# Altium schematic sheet 05- MCU POWER.SchDoc: MCU1
size 420 x 297 mm; Revision: 1.0; SheetNumber: 5; SheetTotal: 13; Project: LOW LEVEL ECU
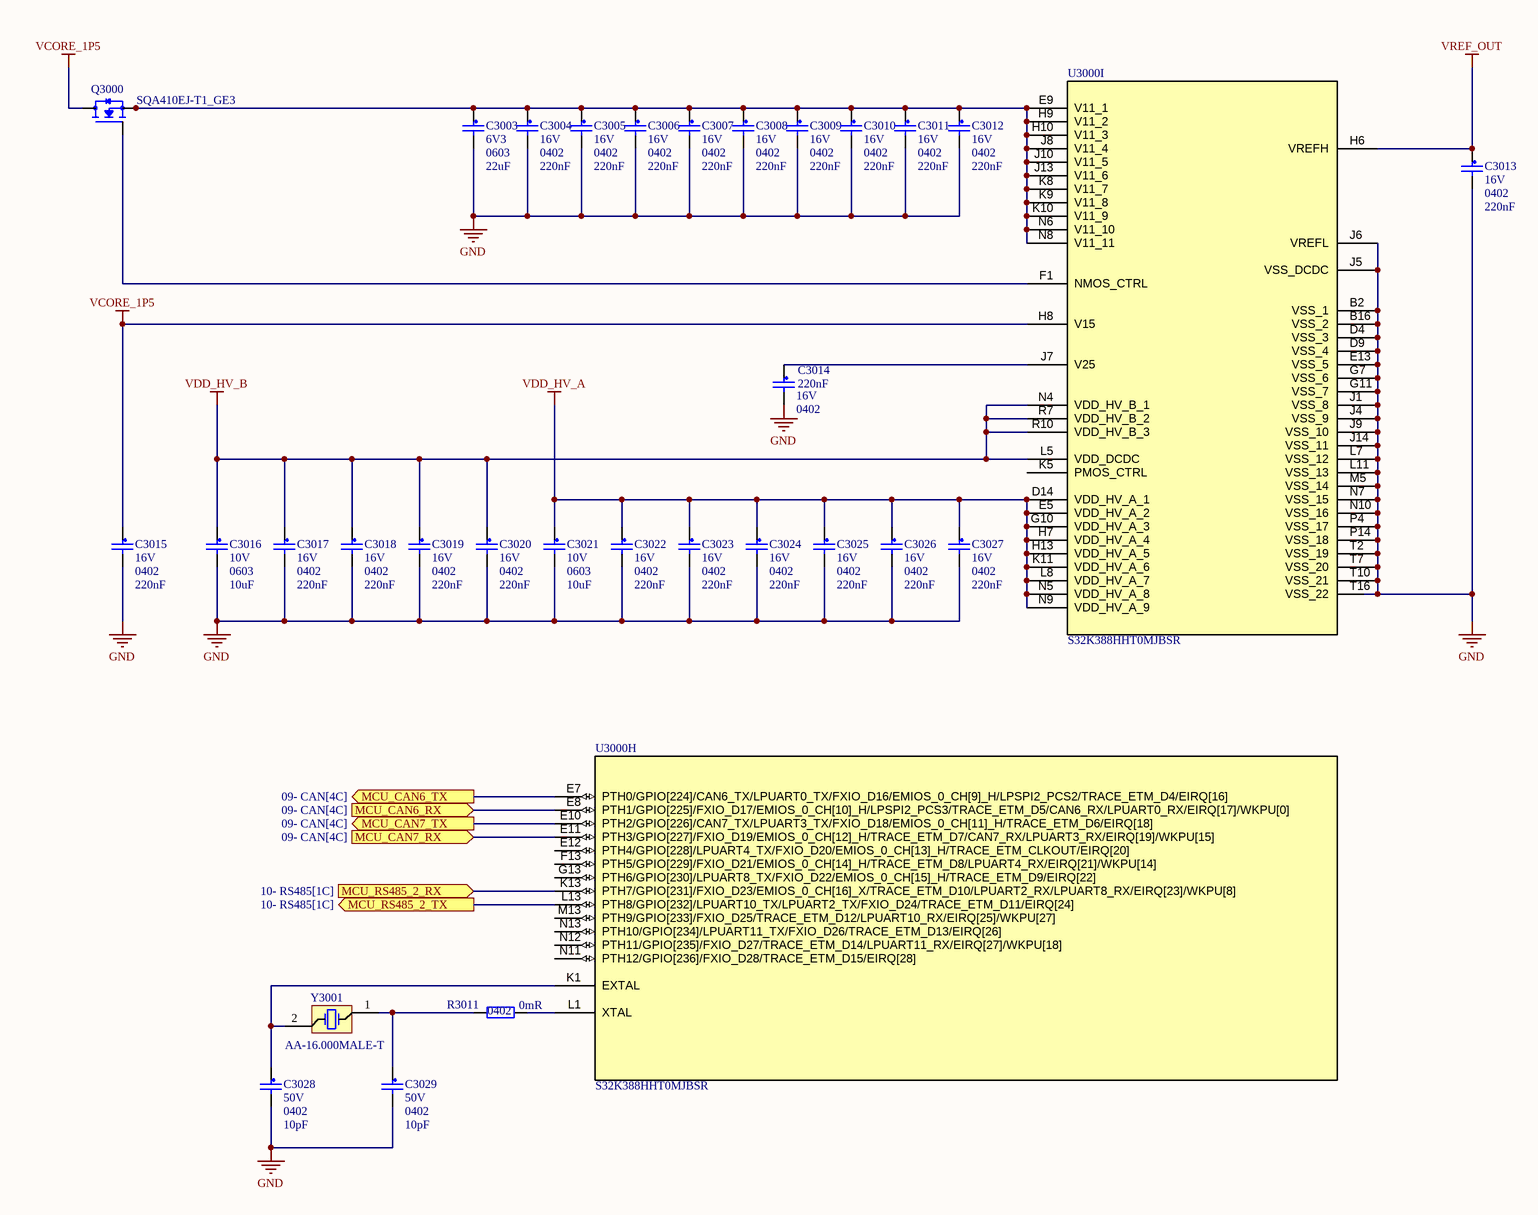
[diagram p0: 05- MCU POWER.SchDoc]

## Parts
C3003  Voltage Rating: 6V3  Case/Package: 0603  Capacitance: 22uF  [CAP0603]  (hidden comment: GRT188C80J226ME13D)
C3004  Voltage Rating: 16V  Case/Package: 0402  Capacitance: 220nF  [CAP0402]  (hidden comment: GCM155R71C224KE02D)
C3005  Voltage Rating: 16V  Case/Package: 0402  Capacitance: 220nF  [CAP0402]  (hidden comment: GCM155R71C224KE02D)
C3006  Voltage Rating: 16V  Case/Package: 0402  Capacitance: 220nF  [CAP0402]  (hidden comment: GCM155R71C224KE02D)
C3007  Voltage Rating: 16V  Case/Package: 0402  Capacitance: 220nF  [CAP0402]  (hidden comment: GCM155R71C224KE02D)
C3008  Voltage Rating: 16V  Case/Package: 0402  Capacitance: 220nF  [CAP0402]  (hidden comment: GCM155R71C224KE02D)
C3009  Voltage Rating: 16V  Case/Package: 0402  Capacitance: 220nF  [CAP0402]  (hidden comment: GCM155R71C224KE02D)
C3010  Voltage Rating: 16V  Case/Package: 0402  Capacitance: 220nF  [CAP0402]  (hidden comment: GCM155R71C224KE02D)
C3011  Voltage Rating: 16V  Case/Package: 0402  Capacitance: 220nF  [CAP0402]  (hidden comment: GCM155R71C224KE02D)
C3012  Voltage Rating: 16V  Case/Package: 0402  Capacitance: 220nF  [CAP0402]  (hidden comment: GCM155R71C224KE02D)
C3013  Voltage Rating: 16V  Case/Package: 0402  Capacitance: 220nF  [CAP0402]  (hidden comment: GCM155R71C224KE02D)
C3014  Voltage Rating: 16V  Case/Package: 0402  Capacitance: 220nF  [CAP0402]  (hidden comment: GCM155R71C224KE02D)
C3015  Voltage Rating: 16V  Case/Package: 0402  Capacitance: 220nF  [CAP0402]  (hidden comment: GCM155R71C224KE02D)
C3016  Voltage Rating: 10V  Case/Package: 0603  Capacitance: 10uF  [CAP0603]  (hidden comment: CL10A106MP8NNNC)
C3017  Voltage Rating: 16V  Case/Package: 0402  Capacitance: 220nF  [CAP0402]  (hidden comment: GCM155R71C224KE02D)
C3018  Voltage Rating: 16V  Case/Package: 0402  Capacitance: 220nF  [CAP0402]  (hidden comment: GCM155R71C224KE02D)
C3019  Voltage Rating: 16V  Case/Package: 0402  Capacitance: 220nF  [CAP0402]  (hidden comment: GCM155R71C224KE02D)
C3020  Voltage Rating: 16V  Case/Package: 0402  Capacitance: 220nF  [CAP0402]  (hidden comment: GCM155R71C224KE02D)
C3021  Voltage Rating: 10V  Case/Package: 0603  Capacitance: 10uF  [CAP0603]  (hidden comment: CL10A106MP8NNNC)
C3022  Voltage Rating: 16V  Case/Package: 0402  Capacitance: 220nF  [CAP0402]  (hidden comment: GCM155R71C224KE02D)
C3023  Voltage Rating: 16V  Case/Package: 0402  Capacitance: 220nF  [CAP0402]  (hidden comment: GCM155R71C224KE02D)
C3024  Voltage Rating: 16V  Case/Package: 0402  Capacitance: 220nF  [CAP0402]  (hidden comment: GCM155R71C224KE02D)
C3025  Voltage Rating: 16V  Case/Package: 0402  Capacitance: 220nF  [CAP0402]  (hidden comment: GCM155R71C224KE02D)
C3026  Voltage Rating: 16V  Case/Package: 0402  Capacitance: 220nF  [CAP0402]  (hidden comment: GCM155R71C224KE02D)
C3027  Voltage Rating: 16V  Case/Package: 0402  Capacitance: 220nF  [CAP0402]  (hidden comment: GCM155R71C224KE02D)
C3028  Voltage Rating: 50V  Case/Package: 0402  Capacitance: 10pF  [CAP0402]  (hidden comment: GCM1555C1H100JA16D)
C3029  Voltage Rating: 50V  Case/Package: 0402  Capacitance: 10pF  [CAP0402]  (hidden comment: GCM1555C1H100JA16D)
Q3000  SQA410EJ-T1_GE3  [PowerPAK® SC-70-6]
R3011  Resistance: 0mR  Case/Package: 0402  [RES0402]  (hidden comment: RMCF0402ZT0R00)
U3000  S32K388HHT0MJBSR  [BGA289C80P17X17_1400X1400X152]  (parts H,I of 9)
Y3001  AA-16.000MALE-T  [CRYSTAL5032]

## Ports
MCU_CAN6_RX (in, see 09- CAN[4C]), MCU_CAN6_TX (out, see 09- CAN[4C]), MCU_CAN7_RX (in, see 09- CAN[4C]), MCU_CAN7_TX (out, see 09- CAN[4C]), MCU_RS485_2_RX (in, see 10- RS485[1C]), MCU_RS485_2_TX (out, see 10- RS485[1C])

## Nets
GND: C3003.2 C3004.2 C3005.2 C3006.2 C3007.2 C3008.2 C3009.2 C3010.2 C3011.2 C3012.2 C3013.2 C3014.2 C3015.2 C3016.2 C3017.2 C3018.2 C3019.2 C3020.2 C3021.2 C3022.2 C3023.2 C3024.2 C3025.2 C3026.2 C3027.2 C3028.2 C3029.2 U3000.B2(VSS_1) U3000.B16(VSS_2) U3000.D4(VSS_3) U3000.D9(VSS_4) U3000.E13(VSS_5) U3000.G7(VSS_6) U3000.G11(VSS_7) U3000.J1(VSS_8) U3000.J4(VSS_9) U3000.J5(VSS_DCDC) U3000.J6(VREFL) U3000.J9(VSS_10) U3000.J14(VSS_11) U3000.L7(VSS_12) U3000.L11(VSS_13) U3000.M5(VSS_14) U3000.N7(VSS_15) U3000.N10(VSS_16) U3000.P4(VSS_17) U3000.P14(VSS_18) U3000.T2(VSS_19) U3000.T7(VSS_20) U3000.T10(VSS_21) U3000.T16(VSS_22)
VCORE_1P5: C3015.1 Q3000.1_2_5_6(D) U3000.H8(V15)
VDD_HV_A: C3021.1 C3022.1 C3023.1 C3024.1 C3025.1 C3026.1 C3027.1 U3000.D14(VDD_HV_A_1) U3000.E5(VDD_HV_A_2) U3000.G10(VDD_HV_A_3) U3000.H7(VDD_HV_A_4) U3000.H13(VDD_HV_A_5) U3000.K11(VDD_HV_A_6) U3000.L8(VDD_HV_A_7) U3000.N5(VDD_HV_A_8) U3000.N9(VDD_HV_A_9)
VDD_HV_B: C3016.1 C3017.1 C3018.1 C3019.1 C3020.1 U3000.L5(VDD_DCDC) U3000.N4(VDD_HV_B_1) U3000.R7(VDD_HV_B_2) U3000.R10(VDD_HV_B_3)
VREF_OUT: C3013.1 U3000.H6(VREFH)
MCU_CAN6_RX: U3000.E8(PTH1/GPIO[225]/FXIO_D17/EMIOS_0_CH[10]_H/LPSPI2_PCS3/TRACE_ETM_D5/CAN6_RX/LPUART0_RX/EIRQ[17]/WKPU[0]) ; port MCU_CAN6_RX
MCU_CAN6_TX: U3000.E7(PTH0/GPIO[224]/CAN6_TX/LPUART0_TX/FXIO_D16/EMIOS_0_CH[9]_H/LPSPI2_PCS2/TRACE_ETM_D4/EIRQ[16]) ; port MCU_CAN6_TX
MCU_CAN7_RX: U3000.E11(PTH3/GPIO[227]/FXIO_D19/EMIOS_0_CH[12]_H/TRACE_ETM_D7/CAN7_RX/LPUART3_RX/EIRQ[19]/WKPU[15]) ; port MCU_CAN7_RX
MCU_CAN7_TX: U3000.E10(PTH2/GPIO[226]/CAN7_TX/LPUART3_TX/FXIO_D18/EMIOS_0_CH[11]_H/TRACE_ETM_D6/EIRQ[18]) ; port MCU_CAN7_TX
MCU_RS485_2_RX: U3000.K13(PTH7/GPIO[231]/FXIO_D23/EMIOS_0_CH[16]_X/TRACE_ETM_D10/LPUART2_RX/LPUART8_RX/EIRQ[23]/WKPU[8]) ; port MCU_RS485_2_RX
MCU_RS485_2_TX: U3000.L13(PTH8/GPIO[232]/LPUART10_TX/LPUART2_TX/FXIO_D24/TRACE_ETM_D11/EIRQ[24]) ; port MCU_RS485_2_TX
NetC3003_1: C3003.1 C3004.1 C3005.1 C3006.1 C3007.1 C3008.1 C3009.1 C3010.1 C3011.1 C3012.1 Q3000.4(S) Q3000.7(S) U3000.E9(V11_1) U3000.H9(V11_2) U3000.H10(V11_3) U3000.J8(V11_4) U3000.J10(V11_5) U3000.J13(V11_6) U3000.K8(V11_7) U3000.K9(V11_8) U3000.K10(V11_9) U3000.N6(V11_10) U3000.N8(V11_11)
NetC3014_1: C3014.1 U3000.J7(V25)
NetC3028_1: C3028.1 U3000.K1(EXTAL) Y3001.2(OSC2)
NetC3029_1: C3029.1 R3011.1 Y3001.1(OSC1)
NetQ3000_3: Q3000.3(G) U3000.F1(NMOS_CTRL)
NetR3011_2: R3011.2 U3000.L1(XTAL)

Not connected (* = marked no-connect by the designer): U3000 E12(PTH4/GPIO[228]/LPUART4_TX/FXIO_D20/EMIOS_0_CH[13]_H/TRACE_ETM_CLKOUT/EIRQ[20]) F13(PTH5/GPIO[229]/FXIO_D21/EMIOS_0_CH[14]_H/TRACE_ETM_D8/LPUART4_RX/EIRQ[21]/WKPU[14]) G13(PTH6/GPIO[230]/LPUART8_TX/FXIO_D22/EMIOS_0_CH[15]_H/TRACE_ETM_D9/EIRQ[22]) K5(PMOS_CTRL) M13(PTH9/GPIO[233]/FXIO_D25/TRACE_ETM_D12/LPUART10_RX/EIRQ[25]/WKPU[27]) N11(PTH12/GPIO[236]/FXIO_D28/TRACE_ETM_D15/EIRQ[28]) N12(PTH11/GPIO[235]/FXIO_D27/TRACE_ETM_D14/LPUART11_RX/EIRQ[27]/WKPU[18]) N13(PTH10/GPIO[234]/LPUART11_TX/FXIO_D26/TRACE_ETM_D13/EIRQ[26])

## Notes on the sheet
- TITLE:
- PROJECT:
- Design by:
- Check by:
- Approve by:
- DRAWING NUMBER:
- REVISION:
- SIZE: A3
- SHEET NUMBER
- OFF
- DATE:

## Library data of the parts
C3003 = CMP-00267-6: CAP CER 22uF 6V3 20% X6S 0603 SMD; Manufacturer 1: Murata Electronics; Crossable(YES/NO): YES; Mount Type(SMD/TH): SMD; Min Operating Temperature: -55°C; Max Operating Temperature: 105°C; Manufacturer Part Number 1: GRT188C80J226ME13D; Height: 0.8mm; Lead Free: Lead Free; Mount: Surface Mount; Voltage Rating (DC): 6V3
C3004-C3015 C3017-C3020 C3022-C3027 = CMP-00362-1: CAP CER 0.22UF 16V X7R 0402; Manufacturer 1: Murata Electronics; Mount Type(SMD/TH): SMD; Crossable(YES/NO): YES; Tolerance: 10%; Weight: 0.000212oz; Min Operating Temperature: -55°C; Packaging: Tape and Reel; Width: 0.5mm; Manufacturer Part Number 1: GCM155R71C224KE02D; Thickness: 0.022inch; Voltage Rating (DC): 16V; Package Quantity: 10000; Height: 0.5mm; Case Code (Imperial): 0402; Lead Free: Lead Free; Length: 0.039inch; Mount: Surface Mount; Termination: SMD/SMT; Dielectric: X7R; Ratings: AEC-Q200; Max Operating Temperature: 125°C; Case Code (Metric): 1005
C3016 C3021 = CMP-ROOT-0115-5: CAP CER 10uF 10V X5R 0603; Manufacturer 1: Samsung; Tolerance: 20%; Crossable(YES/NO): YES; Mount Type(SMD/TH): SMD; Max Operating Temperature: 85°C; Mount: Surface Mount; Thickness: 0.035inch; Radiation Hardening: No; Width: 0.031inch; Manufacturer Part Number 1: CL10A106MP8NNNC; Case Code (Imperial): 0603; Package Quantity: 1; Min Operating Temperature: -55°C; Voltage Rating (DC): 10V; Depth: 0.8mm; Dielectric: X5R; Packaging: Tape and Reel; Contact Plating: Tin; Height: 0.8mm; Length: 1.6mm; Lead Free: Lead Free; Case Code (Metric): 1608
C3028 C3029 = CMP-00258-4: CAP CER 10pF 50V 5% C0G 0402 SMD; Manufacturer 1: Murata Electronics; Crossable(YES/NO): YES; Weight: 0.000212oz; Case Code (Metric): 1005; Mount: Surface Mount; Tolerance: 5%; Lead Free: Lead Free; Width: 0.02inch; Packaging: Tape and Reel; Height: 0.5mm; Length: 0.039inch; Min Operating Temperature: -55°C; Thickness: 0.022inch; Voltage Rating (DC): 50V; Package Quantity: 10000; Manufacturer Part Number 1: GCM1555C1H100JA16D; Case Code (Imperial): 0402; Ratings: AEC-Q200; Mount Type(SMD/TH): SMD; Dielectric: C0G; Max Operating Temperature: 125°C; REACH SVHC: No SVHC; Termination: SMD/SMT
Q3000 = CMP-01172-1: MOSFET N-CH 20V 7.8A PPAK SC70-6; Manufacturer: Vishay; Manufacturer Package Identifier: C-07431-SINGLE; Manufacturer Part Number: SQA410EJ-T1-GE3; Element Configuration: Single; Drain to Source Resistance: 23mΩ; Fall Time: 8ns; Gate to Source Voltage (Vgs): 8V; Input Capacitance: 485pF; Max Junction Temperature (Tj): 175°C; Max Power Dissipation: 13.6W; Number of Channels: 1; Rds On Max: 28mΩ; Threshold Voltage: 600mV; Turn-Off Delay Time: 21ns; Category: MOSFETs; Continuous Drain Current (ID): 7.8A; Drain to Source Breakdown Voltage: 20V; Drain to Source Voltage (Vdss): 20V; Height: 800µm; Max Operating Temperature: 175°C; Min Operating Temperature: -55°C; Mounting Technology: Surface Mount; Number of Elements: 1; Pins: 6; Packaging: Tape & Reel (TR); Power Dissipation: 13.6W; Radiation Hardening: No; REACH SVHC: Unknown; Rise Time: 8ns; RoHS: Compliant; Schedule B: 8541290080; Turn-On Delay Time: 8ns
R3011 = CMP-ROOT-0037-10: RES 0R 1/16W 1% 0402 SMD; Manufacturer 1: Stackpole Electronics Inc; Max Power Dissipation: 63mW; Crossable(YES/NO): YES; Current Rating: 1A; Working Voltage: 50V; Height: 0.016inch; Radiation Hardening: No; Max Operating Temperature: 155°C; Min Operating Temperature: -55°C; Lead Free: Lead Free; Contact Plating: Tin,Matte; Number of Terminations: 2; Features: Automotive AEC-Q200; Case Code (Metric): 1005; Mount: Surface Mount; Packaging: Tape and Reel; Width: 0.02inch; Mount Type(SMD/TH): SMD; Length: 0.039inch; Depth: 0.5mm; Composition: Thick Film; Power Rating: 63mW; Military Standard: Not; Case Code (Imperial): 0402; Manufacturer Part Number 1: RMCF0402ZT0R00
U3000 = CMP-01150-1: ARM® Cortex®-M7F S32K3 Microcontroller IC 32-Bit 5-Core 320MHz 8MB (8M x 8) FLASH 289-LFBGA (14x14); Manufacturer: NXP Semiconductors; Category: Microcontrollers; Manufacturer Part Number: S32K388HHT0MJBSR
Y3001 = CMP-01173-1: CRYSTAL 16.0000MHZ 12PF SMD; Manufacturer: TXC; ESR (Equivalent Series Resistance): 100Ω; Frequency: 16MHz; Frequency Stability: 150ppm; Frequency Tolerance: 0.003%; Case/Package: SMD/SMT; Category: Crystals; Height: 1.3462mm; Length: 5.0038mm; Lifecycle Status: Production; Load Capacitance: 12pF; Manufacturer Part Number: AA-16.000MALE-T; Max Operating Temperature: 125°C; Min Operating Temperature: -40°C; Mounting Technology: Surface Mount; Pins: 2; Packaging: Tape & Reel; Ratings: AEC-Q200; REACH SVHC: No; RoHS: Compliant; Schedule B: 8541600080, 8541600080|8541600080|8541600080|8541600080|8541600080|8541600080|8541600080|8541600080|8541600080|8541600080|8541600080|8541600080|8541600080|8541600080|8541600080|8541600080|8541600080|8541600080|8541600080|8541600080|8541600080|8541600080|8541600080|85; Termination: SMD/SMT; Tolerance: 0.003%; Width: 3.2mm